# EAGLE design akabeacon_square_type1_da14580 (EAGLE 7.2.0)
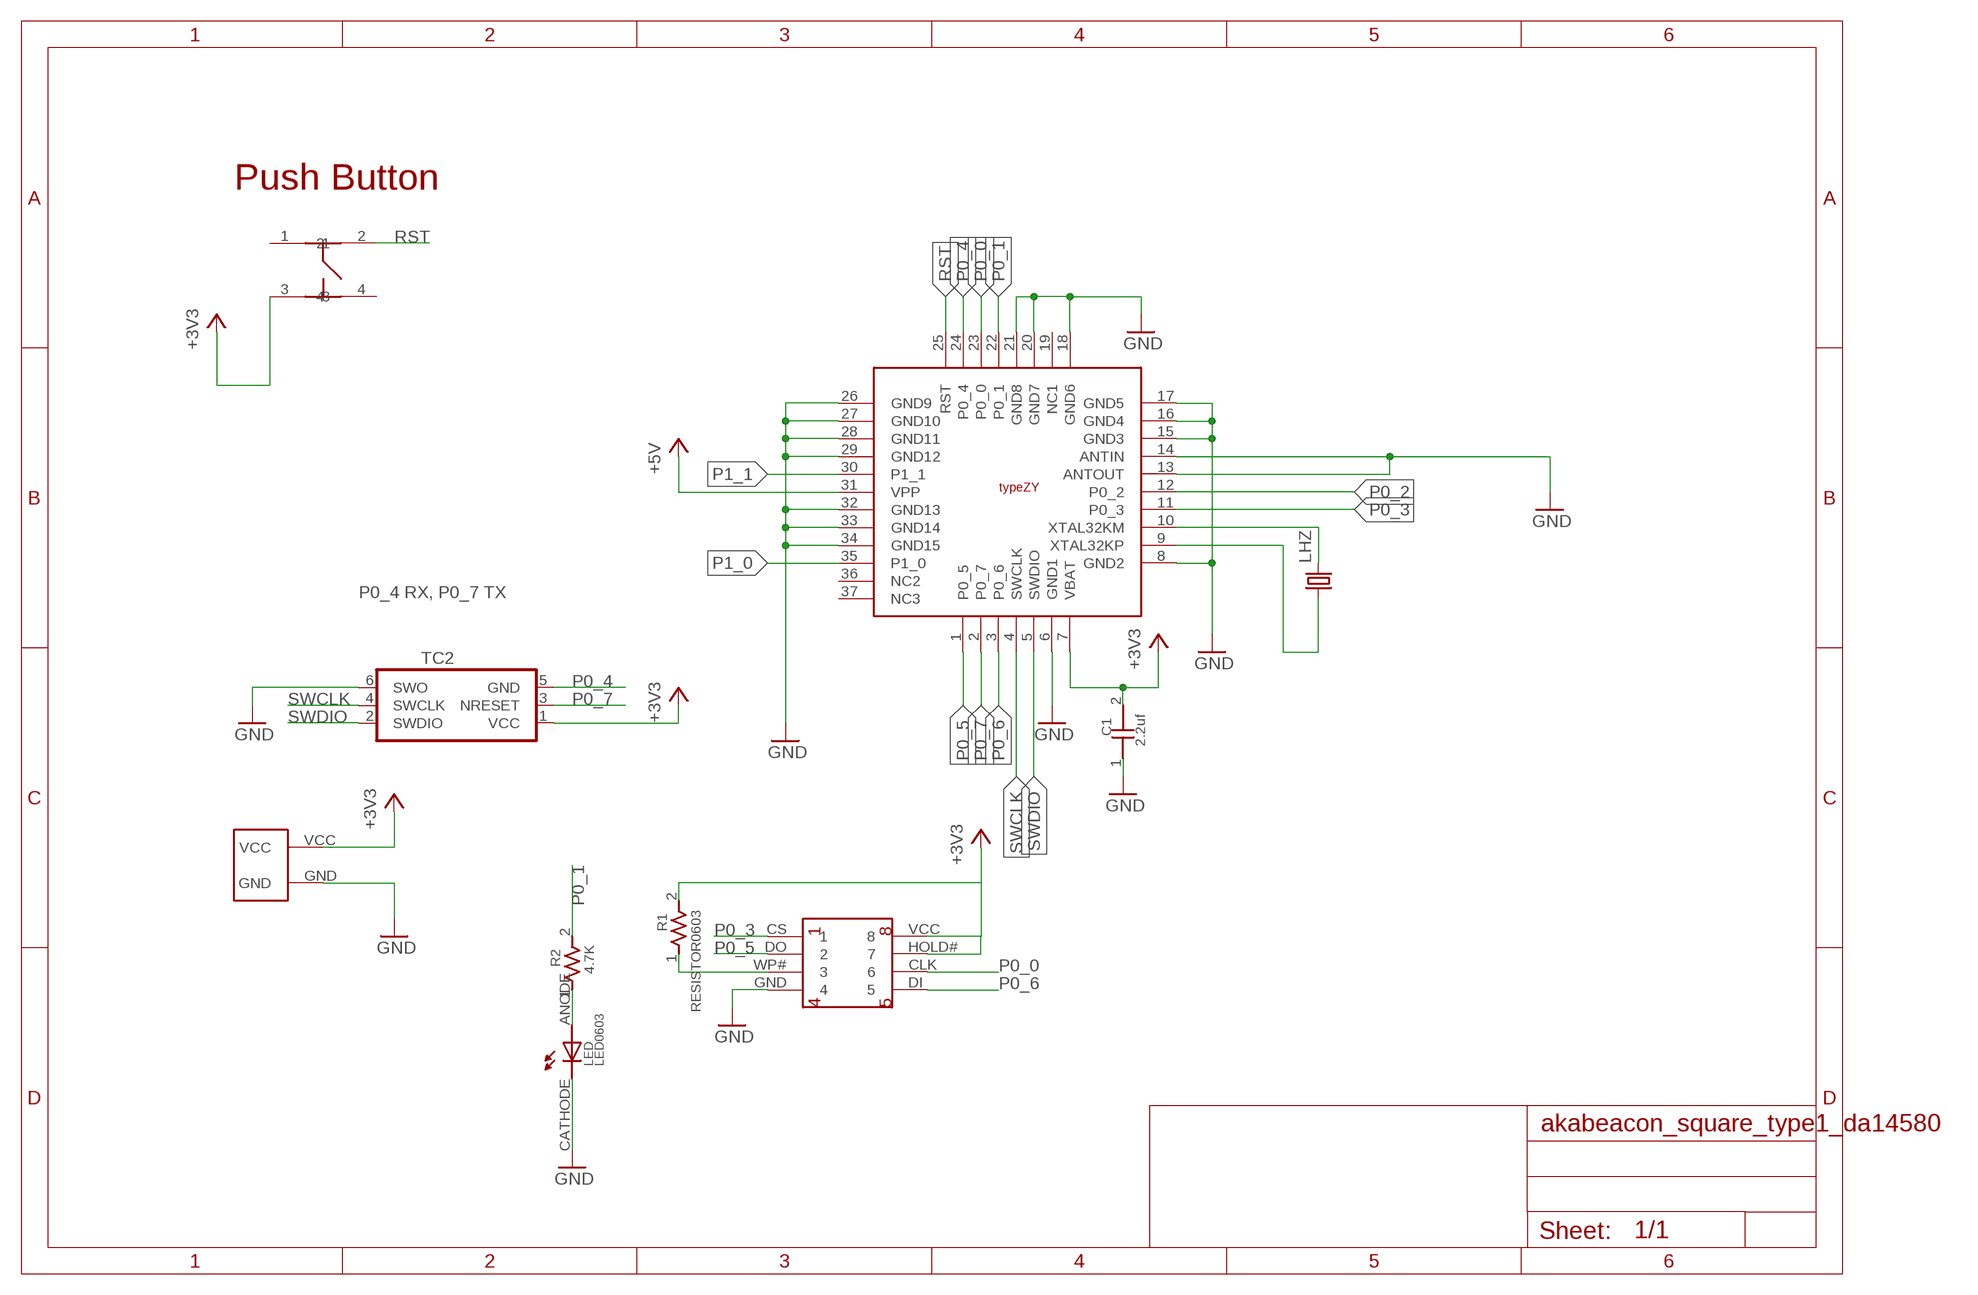
[diagram p0: schematic, sheet 1]

## Parts
C1  2.2uf  CAPACITOR0603  [0603]
LED  LED0603  [0603]
LHZ  FC-12M  [FC-12M]
R1  RESISTOR0603  [0603]
R2  4.7K  RESISTOR0603  [0603]
TC2  TC2030-IDC-NL  [TC2030-IDC-NL]
U$2  SQUARE-TYPE1  [SQUARE-TYPE1-TC2030]
U$3  FLASH-MEMORY-2M(WINBOND)  [FLASH-MEMORY-2M(WINBOND)]
U$7  SWICTH-4P(KMR2)  [SWITCH-4P(KMR2)]
U$9  MURATA-TYPEZY  [MURATA_TYPEZY]

## Nets
+3V3: C1.2 R1.2 TC2.1(VCC) U$2.VCC U$3.HOLD# U$3.VCC U$7.3 U$9.7(VBAT)
+5V: U$9.31(VPP)
GND: C1.1 LED.CATHODE TC2.6(SWO) U$2.GND U$3.GND U$9.6(GND1) U$9.8(GND2) U$9.13(ANTOUT) U$9.14(ANTIN) U$9.15(GND3) U$9.16(GND4) U$9.17(GND5) U$9.18(GND6) U$9.20(GND7) U$9.21(GND8) U$9.26(GND9) U$9.27(GND10) U$9.28(GND11) U$9.29(GND12) U$9.32(GND13) U$9.33(GND14) U$9.34(GND15)
N$1: R1.1 U$3.WP#
N$2: LED.ANODE R2.1
P0_0: U$3.CLK U$9.23(P0_0)
P0_1: R2.2 U$9.22(P0_1)
P0_2: U$9.12(P0_2)
P0_3: U$3.CS U$9.11(P0_3)
P0_4: TC2.5(GND) U$9.24(P0_4)
P0_5: U$3.DO U$9.1(P0_5)
P0_6: U$3.DI U$9.3(P0_6)
P0_7: TC2.3(NRESET) U$9.2(P0_7)
P1_0: U$9.35(P1_0)
P1_1: U$9.30(P1_1)
RST: U$7.2 U$9.25(RST)
SWCLK: TC2.4(SWCLK) U$9.4(SWCLK)
SWDIO: TC2.2(SWDIO) U$9.5(SWDIO)
XTAL32KM: LHZ.2 U$9.10(XTAL32KM)
XTAL32KP: LHZ.1 U$9.9(XTAL32KP)
Unconnected: U$7.1 U$7.4 U$9.19(NC1) U$9.36(NC2) U$9.37(NC3)

## Notes on the sheet
- Push Button
- P0_4 RX, P0_7 TX

## Library data of the parts
C1 = GClue-Capacitor:CAPACITOR
LED = GClue-LED:LED
LHZ = crystal:FC-12M: kHz RANGE CRYSTAL UNIT LOW PROFILE SMD Source: Epson Toyocom FC-12M.pdf
R1 R2 = GClue-Resistors:RESISTOR
TC2 = TagConnect:TC2030-IDC: Tag-Connect In Circuit Programming & Debug Cable 6 Pin http://www.tag-connect.com
U$2 = GClue-Beacon:SQUARE-TYPE1
U$3 = gclue:FLASH-MEMORY-2M(WINBOND)
U$7 = gclue-test:SWICTH-4P(KMR2)
U$9 = GClueBT:MURATA-TYPEZY

## Board
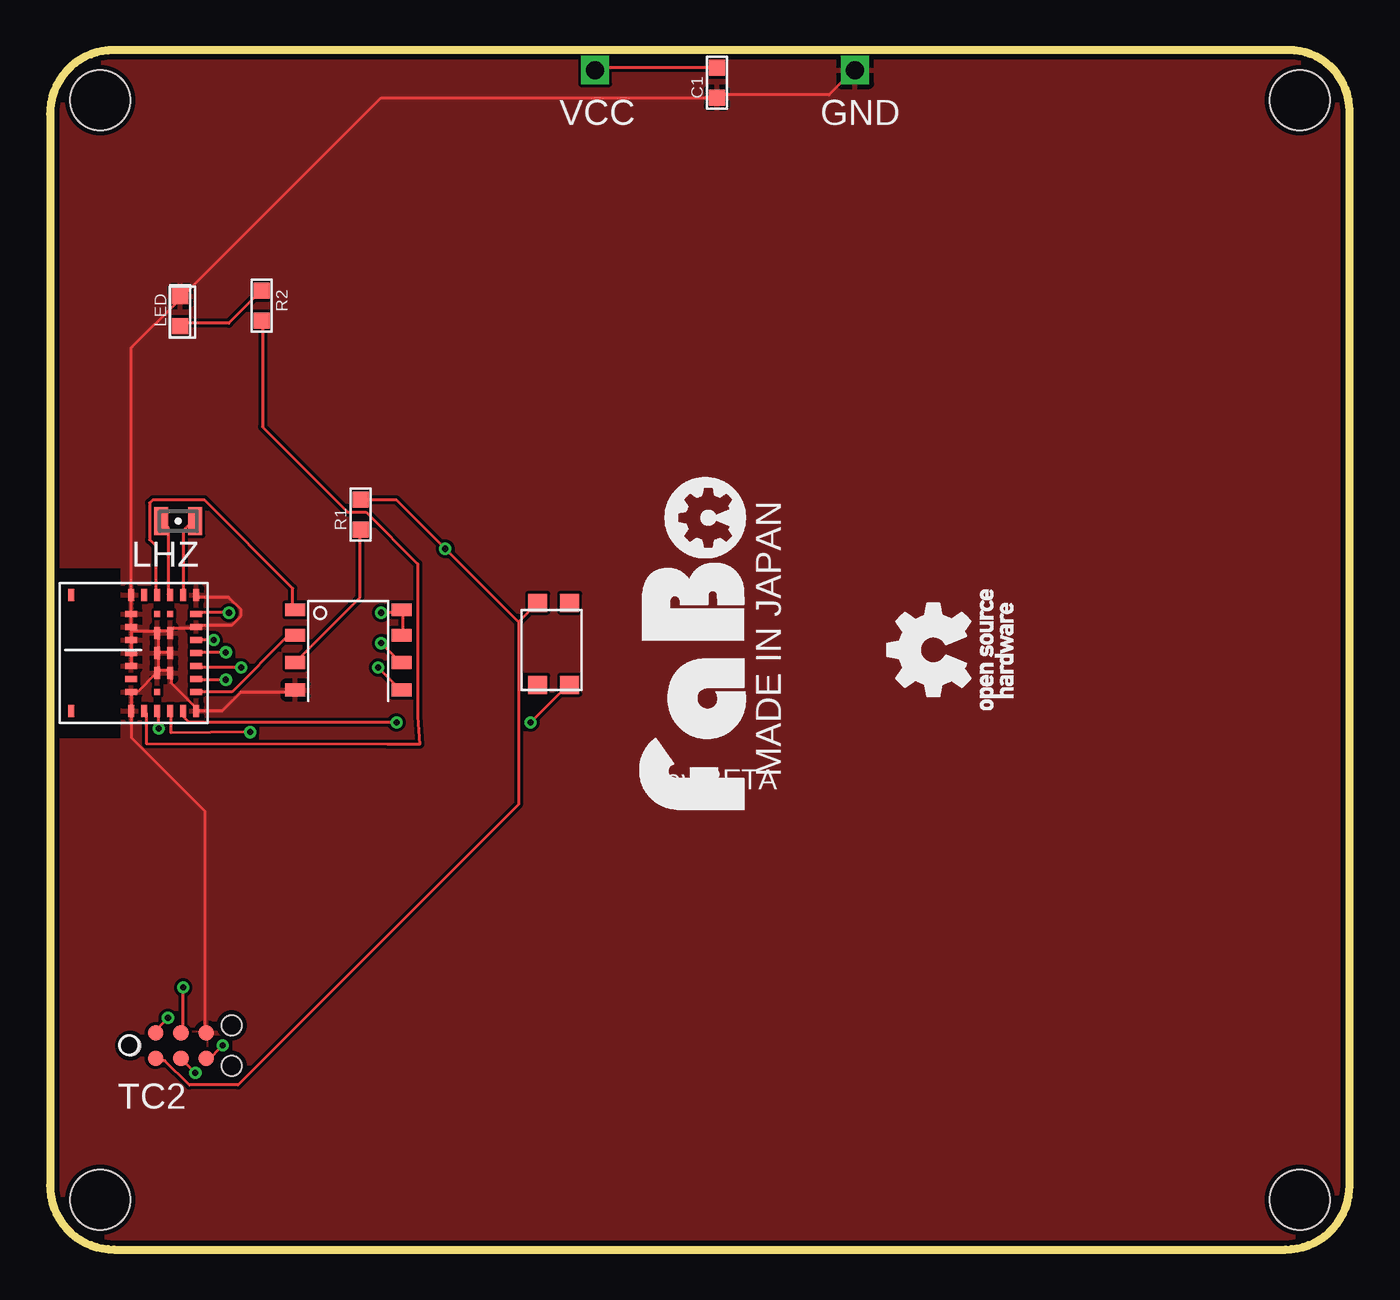
[diagram p1: board, top side]
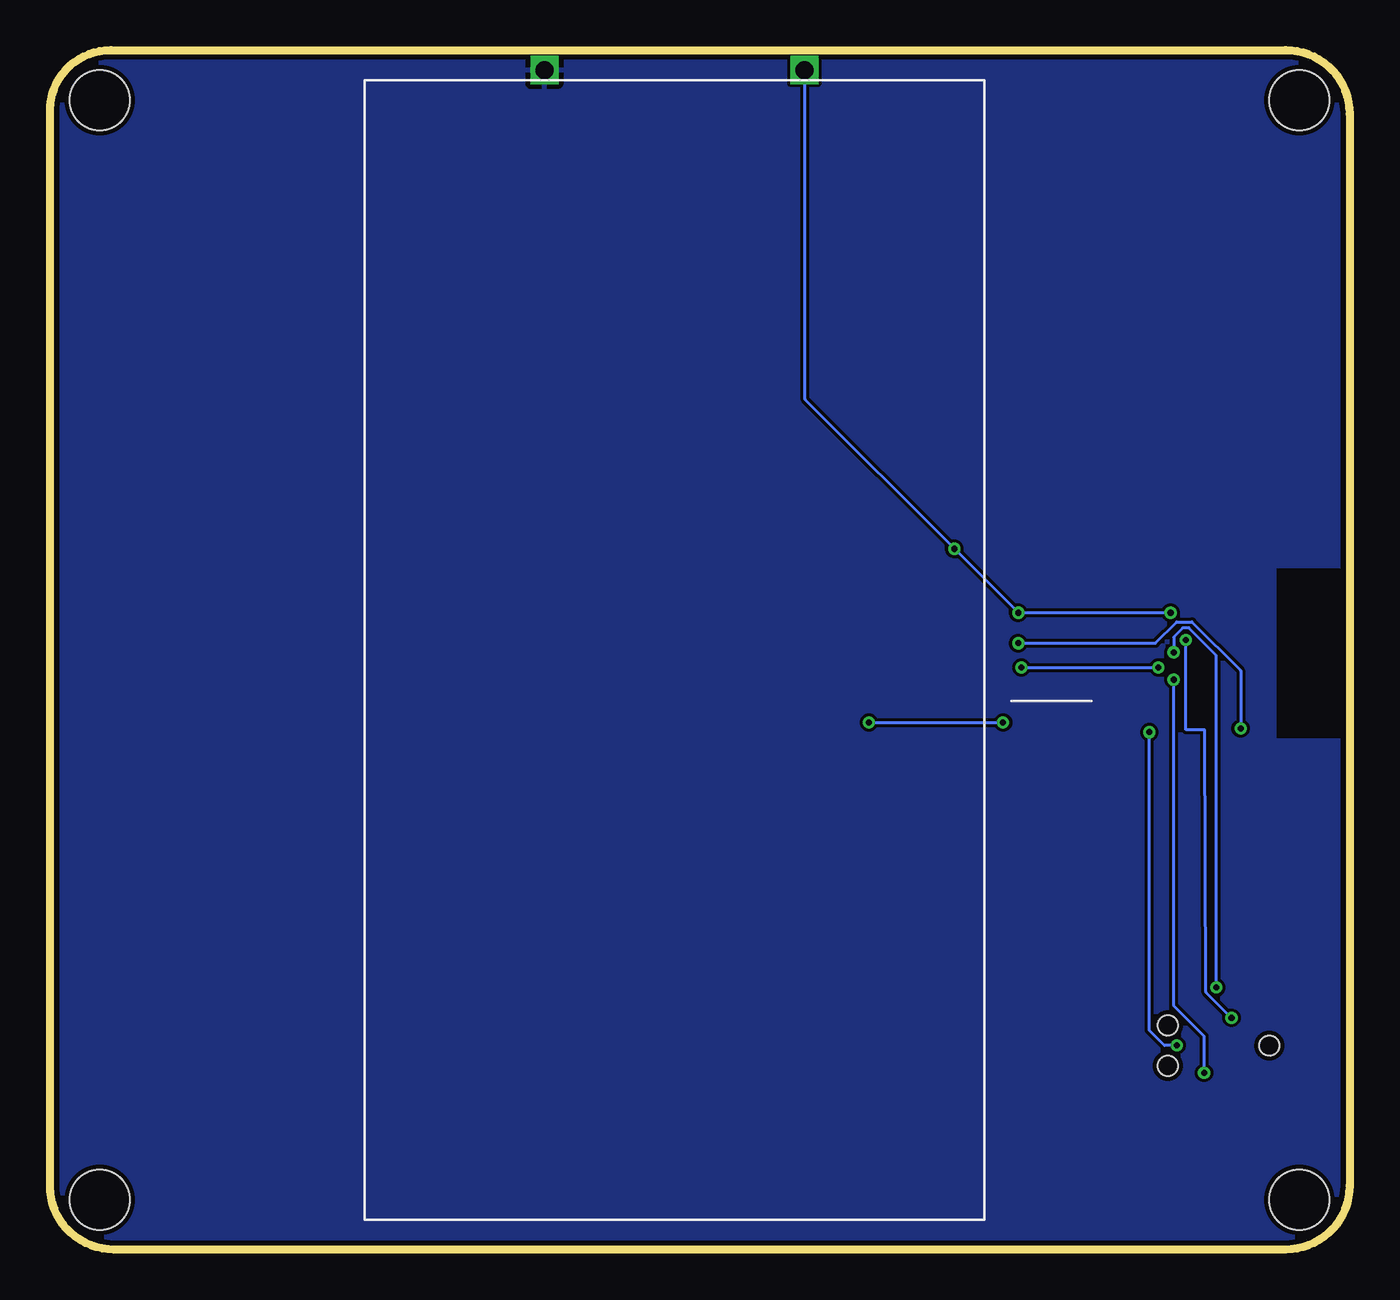
[diagram p2: board, bottom side, seen from below]

Size 65 x 60 mm. Coordinates in mm from the lower left corner, seen from the top.
Copper layers (1*16): Top 0.035mm / dielectric 1.5mm / Bottom 0.035mm
Design rules "SeeedStudio_2layer_DRU_no_angle_20140221": minimum track width 6mil, minimum drill 12mil, track to track 6mil, track to pad 6mil, pad to pad 6mil, via to via 6mil, smd to smd 0mil, copper to edge 10mil, drill to drill 10mil, minimum pad ring 10mil, minimum via ring 6mil, stop-mask expansion 2mil, vias tented up to drill 100mil, thermal gap 10mil
tRestrict: area -2.7,25.6 to 3.5,34.1
bRestrict: area -2.5,25.6 to 3.6,34.1

### Footprints (pad centres in the part's own frame; a part is rotated, then mirrored left to right if it is on the bottom)
0603 = smd 0.8 x 0.8: 1 -0.75,0; 2 0.75,0
0603' = smd 0.8 x 0.8: ANODE -0.75,0; CATHODE 0.75,0
FC-12M = smd 0.7 x 1.4: 1 -0.85,0; 2 0.85,0
TC2030-IDC-NL = smd 0.787 x 0.787: 1 -1.27,-0.635; 2 -1.27,0.635; 3 0,-0.635; 4 0,0.635; 5 1.27,-0.635; 6 1.27,0.635 | hole 0.991: -2.54,0; 2.54,1.016; 2.54,-1.016
SQUARE-TYPE1-TC2030 = drill 0.9 square: GND 7.77,29; VCC -5.23,29 | hole 3: 30.02,27.48; 30.02,-27.52; -29.98,-27.52; -29.98,27.48
FLASH-MEMORY-2M(WINBOND) = smd 1 x 0.635: CLK 2.67,0.2; CS -2.64,2.84; DI 2.67,-1.17; DO -2.64,1.57; GND -2.64,-1.17; HOLD# 2.67,1.57; VCC 2.67,2.84; WP# -2.64,0.2
SWITCH-4P(KMR2) = smd 0.9 x 0.95: 1 -1,0; 2 3.1,0; 3 -1,-1.6; 4 3.1,-1.6
MURATA_TYPEZY = smd 0.3 x 0.6: 1 -1.95,-1.625; 2 -1.3,-1.625; 3 -0.65,-1.625; 4 0,-1.625; 5 0.65,-1.625; 6 1.3,-1.625; 7 1.95,-1.625; 14 1.95,1.625; 15 1.3,1.625; 16 0.65,1.625; 17 0,1.625; 18 -0.65,1.625; 19 -1.3,1.625; 20 -1.95,1.625 | smd 0.6 x 0.3: 8 2.9,-1.625; 9 2.9,-0.975; 10 2.9,-0.325; 11 2.9,0.325; 12 2.9,0.975; 13 2.9,1.625; 21 -2.9,1.625; 22 -2.9,0.975; 23 -2.9,0.325; 24 -2.9,-0.325; 25 -2.9,-0.975; 26 -2.9,-1.625; 27 -1,-0.325; 28 0,-0.325; 29 1,-0.325; 32 1,0.325; 33 0,0.325; 34 -1,0.325; 36 2.9,4.625; 37 -2.9,4.625 | smd 0.3 x 0.3: 30 1.95,-0.325; 31 1.95,0.325; 35 -1.95,0.325

### Placement (x,y rotation side)
C1  33.36,58.36 90 top
LED  LED0603  [0603']  6.52,46.94 90 top
LHZ  6.42,36.43 180 top
R1  15.53,36.76 90 top
R2  10.58,47.22 270 top
TC2  6.55,10.2 0 top
U$2  32.5,30 0 top
U$3  14.91,29.16 0 top
U$7  25.99,31.34 270 top
U$9  5.69,29.84 90 top

### Tracks (layer width: path | path; a pad name or v marks a point on that pad's centre or on a via)
+3V3  (via drill 0.3)
  Top 0.152: 23.43,31.39 23.43,22.25 9.41,8.23 6.97,8.23 5.75,9.45 5.29,9.45 TC2.1 | 23.43,31.39 24.34,32.31 U$7.3 | 23.43,31.39 v19.77,35.05 17.33,37.49 15.65,37.49 R1.2 | C1.2 33.33,59.13 27.39,59.13 U$2.VCC | v8.95,31.85 7.42,31.85 U$9.7 | v16.57,31.85 17.48,31.85 U$3.VCC 17.64,31.85 17.64,30.79 U$3.HOLD#
  Bottom 0.152: v8.95,31.85 v16.57,31.85 v19.77,35.05 27.24,42.52 27.24,58.98 U$2.VCC
GND
  Top 0.152: U$9.20 4.07,26.98 U$9.21 4.07,26.82 4.07,25.6 7.73,21.95 7.73,10.97 TC2.6 | U$9.32 5.44,30.94 5.9,30.94 U$9.29 6.05,30.94 6.21,31.09 7.27,31.09 U$9.6 7.42,31.24 9.1,31.24 9.56,31.7 9.56,32 8.95,32.61 7.42,32.61 U$9.8 | 5.44,29.87 5.9,29.87 U$9.28 | 5.44,28.96 5.9,28.96 U$9.27 6.05,28.8 6.05,28.35 7.27,27.13 7.27,26.98 U$9.26 7.42,26.98 8.64,26.98 9.56,27.89 12.15,27.89 U$3.GND | 5.44,28.96 5.44,29.72 U$9.33 5.44,29.87 | 5.44,28.96 U$9.34 5.29,28.8 4.38,27.89 U$9.20 | 5.44,29.87 5.44,30.79 U$9.32 | U$2.GND 40.19,58.98 38.97,57.76 33.48,57.76 C1.1 33.33,57.61 16.57,57.61 6.66,47.7 LED.CATHODE 6.51,47.55 4.07,45.11 4.07,32.77 U$9.13 4.07,32.61 4.07,31.85 U$9.14 4.07,31.7 4.07,31.24 U$9.15 4.07,31.09 4.07,30.94 | U$9.18 4.07,29.26 4.07,29.72 U$9.17 4.07,29.87 U$9.16 4.07,30.63 4.07,30.94 | 4.07,30.94 5.29,30.94 U$9.32 | U$9.20
  pour Top: -0.5,0 -0.5,61 65.5,61 65.5,0
  pour Bottom: -0.5,0 -0.5,61 65.5,61 65.5,0
N$1
  Top 0.152: R1.1 15.5,35.97 15.5,32.61 12.3,29.41 U$3.WP#
N$2
  Top 0.152: LED.ANODE 6.66,46.33 8.95,46.33 10.47,47.85 R2.1
P0_0  (via drill 0.3)
  Top 0.152: v5.44,26.06 5.44,26.82 U$9.23 | v16.57,30.33 17.48,29.41 U$3.CLK
  Bottom 0.152: v5.44,26.06 5.44,28.96 7.88,31.39 8.64,31.39 9.71,30.33 v16.57,30.33
P0_1
  Top 0.152: U$9.22 4.83,26.82 4.83,25.3 16.86,25.27 18.5,25.27 18.4,26.67 18.4,34.29 15.81,36.88 14.89,36.88 10.62,41.15 10.62,46.33 R2.2
P0_3
  Top 0.152: U$9.11 5.29,32.77 5.29,35.2 4.99,35.51 4.99,37.34 5.14,37.49 7.73,37.49 12.15,33.07 12.15,32 U$3.CS
P0_4  (via drill 0.3)
  Top 0.152: v10.02,25.88 6.05,25.84 6.05,26.82 U$9.24 | v8.64,10.21 7.88,9.45 TC2.5
  Bottom 0.152: v10.02,25.88 10.02,10.97 9.25,10.21 v8.64,10.21
P0_5
  Top 0.152: U$9.1 7.42,27.89 9.1,27.89 11.84,30.63 12.15,30.63 U$3.DO
P0_6  (via drill 0.3)
  Top 0.152: v9.56,29.11 7.42,29.11 U$9.3 | v16.42,29.11 17.48,28.04 U$3.DI
  Bottom 0.152: v16.42,29.11 v9.56,29.11
P0_7  (via drill 0.3)
  Top 0.152: v8.8,28.5 7.42,28.5 U$9.2 | v7.27,8.84 6.66,9.45 TC2.3
  Bottom 0.152: v8.8,28.5 8.8,12.19 7.27,10.67 v7.27,8.84
RST  (via drill 0.3)
  Top 0.152: v17.33,26.36 6.97,26.36 6.66,26.67 6.66,26.82 U$9.25 | v24.04,26.36 25.86,28.19 U$7.2
  Bottom 0.152: v24.04,26.36 v17.33,26.36
SWCLK  (via drill 0.3)
  Top 0.152: v8.8,29.87 7.42,29.87 U$9.4 | v6.66,13.11 6.66,10.97 TC2.4
  Bottom 0.152: v8.8,29.87 8.8,30.63 8.34,31.09 8.03,31.09 6.66,29.72 v6.66,13.11
SWDIO  (via drill 0.3)
  Top 0.152: v8.19,30.48 7.42,30.48 U$9.5 | v5.9,11.58 5.29,10.97 TC2.2
  Bottom 0.152: v8.19,30.48 8.19,26 7.25,26 7.19,12.87 v5.9,11.58
XTAL32KM
  Top 0.152: U$9.10 5.9,32.77 5.9,36.12 5.6,36.42 LHZ.2
XTAL32KP
  Top 0.152: U$9.9 6.66,32.77 6.66,35.97 7.12,36.42 LHZ.1

### Text on the board
tPlace: Rev.BETA